# Altium project PCB_Project.PrjPcb
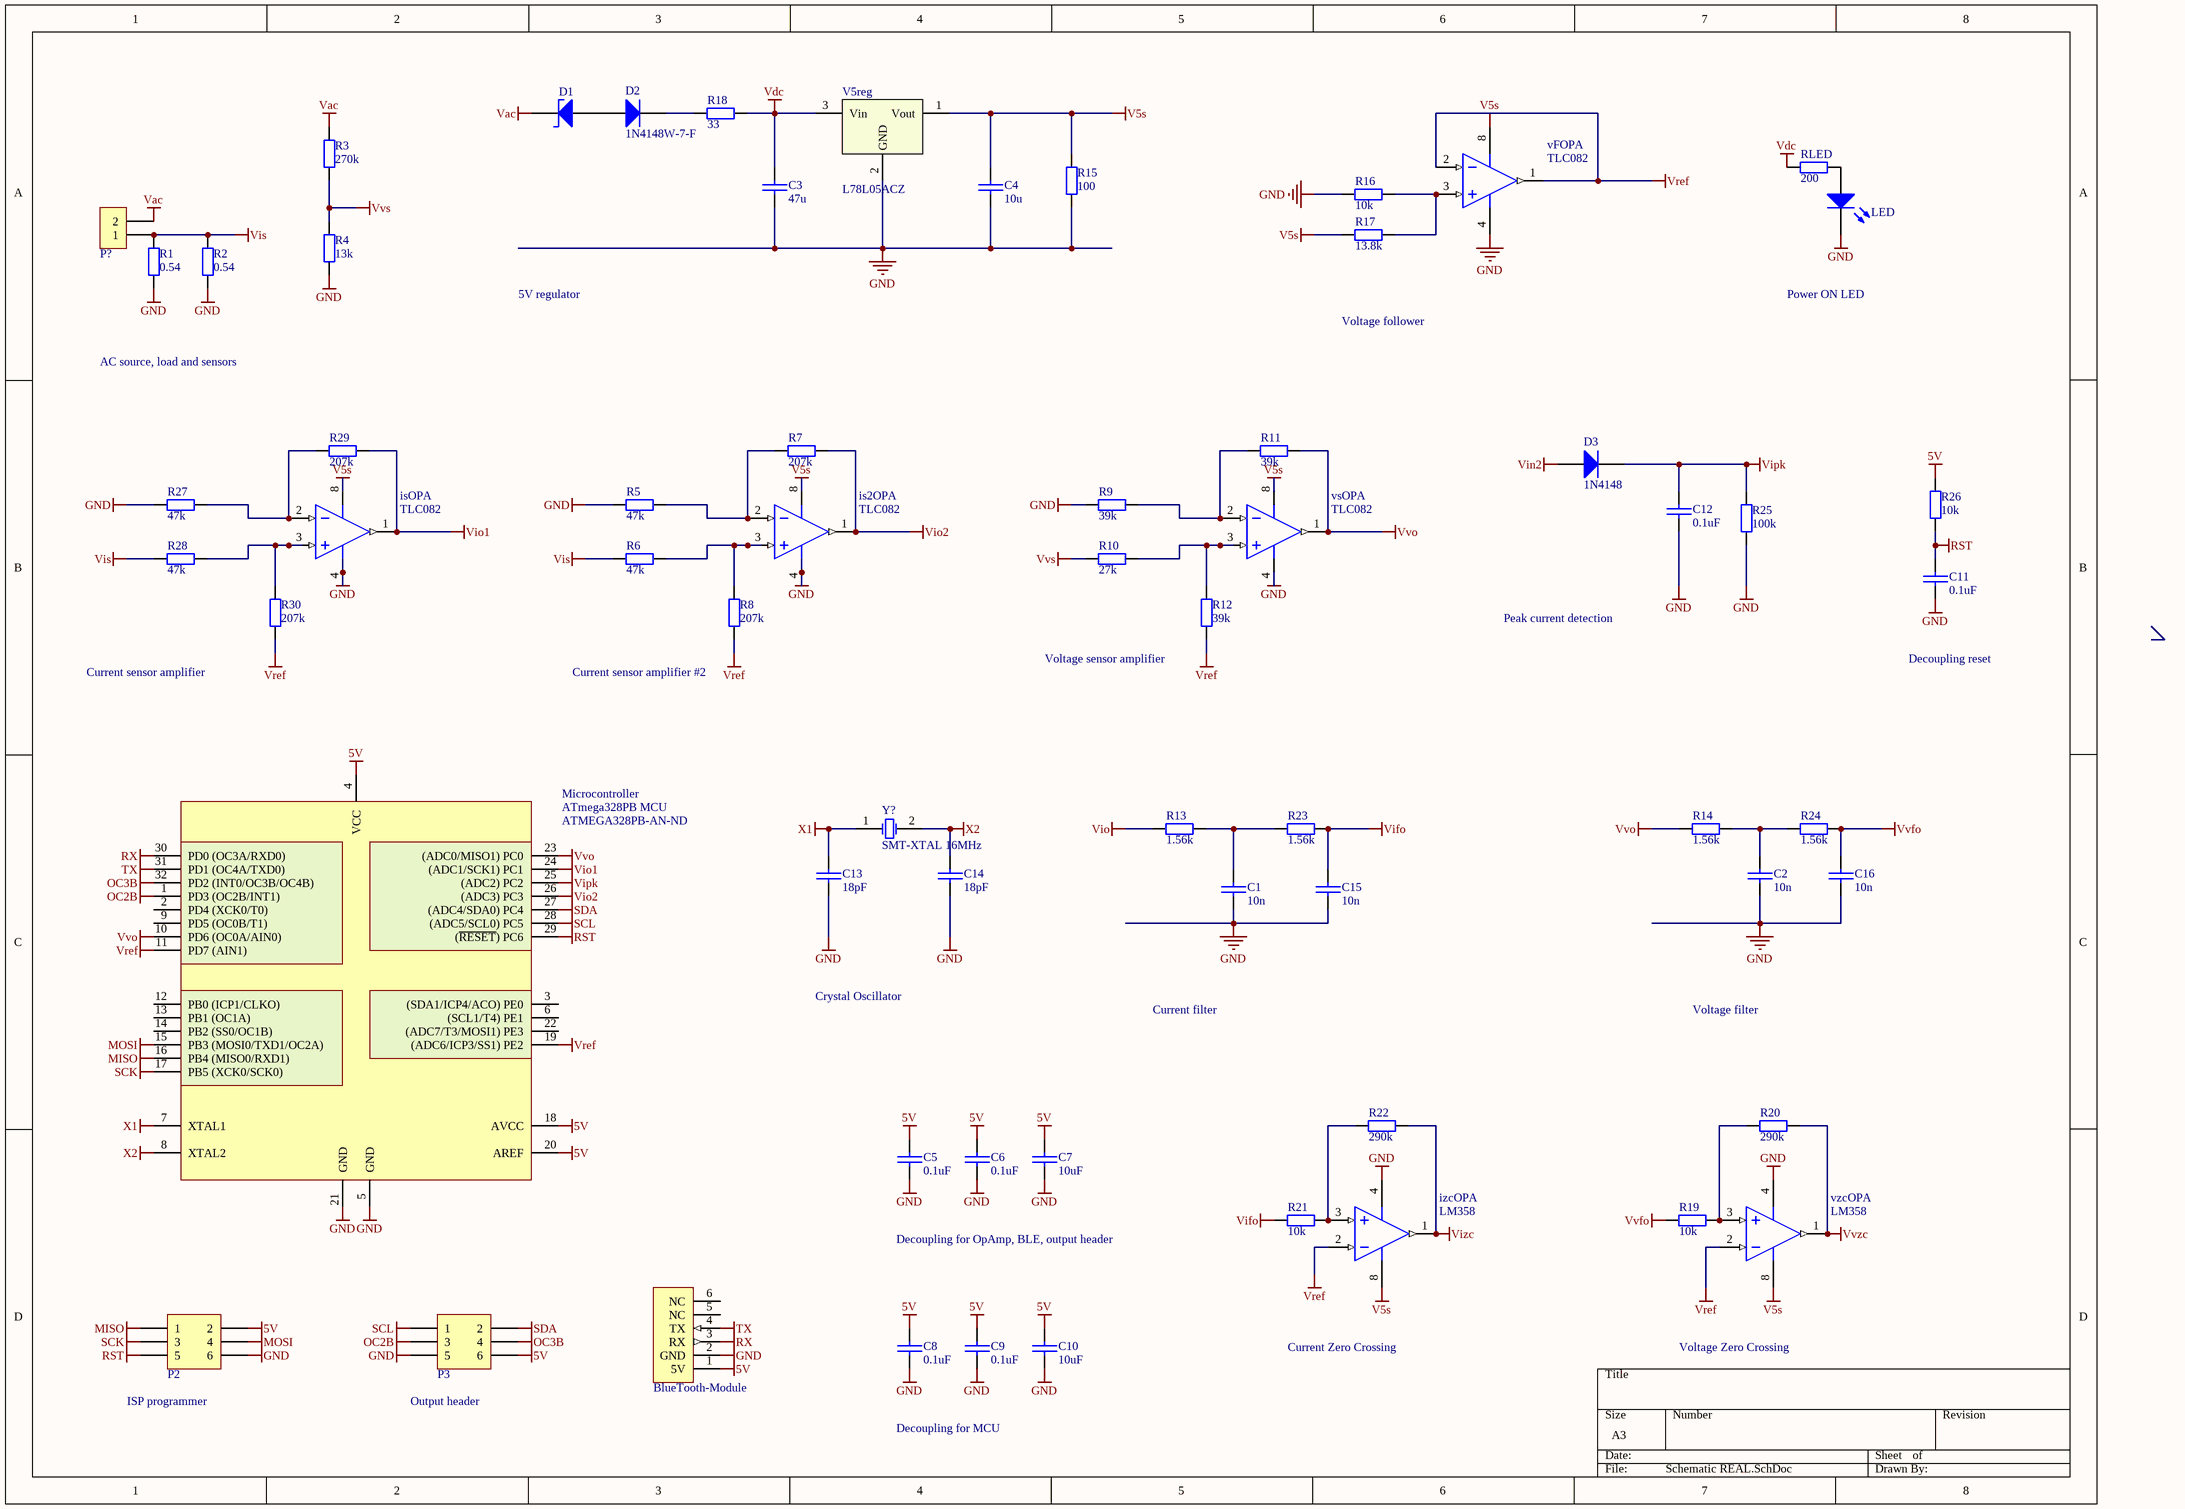
[diagram p0: Schematic REAL.SchDoc]
1 sheet, 64 parts. Net scope: global (net labels, ports and power ports of the same name join across sheets).
Board file: PCB1.PcbDoc

## Sheet Schematic REAL.SchDoc
size A3; SheetNumber: 1; SheetTotal: 1

### Parts
BlueTooth-Module  BLE Module Header  [HM10_HDR1X6]  (value not drawn)
C1  10n  [0805 CAP]
C2  10n  [0805 CAP]
C3  47u  [0805 CAP]
C4  10u  [0805 CAP]
C5  0.1uF  [0805 CAP]
C6  0.1uF  [0805 CAP]
C7  10uF  [0805 CAP]
C8  0.1uF  [0805 CAP]
C9  0.1uF  [0805 CAP]
C10  10uF  [0805 CAP]
C11  0.1uF  [0805 CAP]
C12  0.1uF  [0805 CAP]
C13  18pF  [0805 CAP]
C14  18pF  [0805 CAP]
C15  10n  [0805 CAP]
C16  10n  [0805 CAP]
D1  BZX79-CXVX  [AXIAL-Zener-0.4]  (value not drawn)
D2  1N4148W-7-F  [SOD123]
D3  1N4148  [AXIAL-DIODE-0.4]
is2OP  TLC082  [SO - 8]  (part A of 2)
isOP  TLC082  [SO - 8]  (part A of 2)
izcOP  LM358  [SO - 8]  (part A of 2)
LED  LTST-C170KGKT  [0805 LED]  (value not drawn)
Microcontroller  ATmega328PB MCU  Supplier Part Number 1: ATMEGA328PB-AN-ND  [32 - TQFP]
P2  Header 3X2  [ECE-BHDR2X3]  (value not drawn)
P3  Header 3X2  [ECE-BHDR2X3]  (value not drawn)
P?  Dual Banana Plugs  [Dual Banana Plug]  (value not drawn)
R1  0.54  [0805 RES]
R2  0.54  [0805 RES]
R3  270k  [0805 RES]
R4  13k  [0805 RES]
R5  47k  [0805 RES]
R6  47k  [0805 RES]
R7  207k  [0805 RES]
R8  207k  [0805 RES]
R9  39k  [0805 RES]
R10  27k  [0805 RES]
R11  39k  [0805 RES]
R12  39k  [0805 RES]
R13  1.56k  [0805 RES]
R14  1.56k  [0805 RES]
R15  100  [0805 RES]
R16  10k  [0805 RES]
R17  13.8k  [0805 RES]
R18  33  [0805 RES]
R19  10k  [0805 RES]
R20  290k  [0805 RES]
R21  10k  [0805 RES]
R22  290k  [0805 RES]
R23  1.56k  [0805 RES]
R24  1.56k  [0805 RES]
R25  100k  [0805 RES]
R26  10k  [0805 RES]
R27  47k  [0805 RES]
R28  47k  [0805 RES]
R29  207k  [0805 RES]
R30  207k  [0805 RES]
RLED  200  [0805 RES]
V5reg  L78L05ACZ  [TO-92]
vFOP  TLC082  [SO - 8]  (part A of 2)
vsOP  TLC082  [SO - 8]  (part A of 2)
vzcOP  LM358  [SO - 8]  (part A of 2)
Y?  SMT-XTAL 16MHz  [HC49-US]

### Nets
5V: BlueTooth-Module.1(5V) C5.1 C6.1 C7.1 C8.1 C9.1 C10.1 Microcontroller.4(VCC) Microcontroller.18(AVCC) Microcontroller.20(AREF) P2.2 P3.6 R26.2
GND: BlueTooth-Module.2(GND) C1.2 C2.2 C3.2 C4.2 C5.2 C6.2 C7.2 C8.2 C9.2 C10.2 C11.2 C12.2 C13.2 C14.2 C15.2 C16.2 is2OP.4(VSS) isOP.4(VSS) izcOP.4(VSS) LED.2(K) Microcontroller.5(GND) Microcontroller.21(GND) P2.6 P3.5 R1.1 R2.1 R4.1 R5.1 R9.1 R15.1 R16.1 R25.1 R27.1 V5reg.2(GND) vFOP.4(VSS) vsOP.4(VSS) vzcOP.4(VSS)
MISO: Microcontroller.16(PB4_(MISO0/RXD1)) P2.1
MOSI: Microcontroller.15(PB3_(MOSI0/TXD1/OC2A)) P2.4
OC2B: Microcontroller.1(PD3_(OC2B/INT1)) P3.3
OC3B: Microcontroller.32(PD2_(INT0/OC3B/OC4B)) P3.4
RST: C11.1 Microcontroller.29((~{RESET})_PC6) P2.5 R26.1
RX: BlueTooth-Module.3(RX) Microcontroller.30(PD0_(OC3A/RXD0))
SCK: Microcontroller.17(PB5_(XCK0/SCK0)) P2.3
SCL: Microcontroller.28((ADC5/SCL0)_PC5) P3.1
SDA: Microcontroller.27((ADC4/SDA0)_PC4) P3.2
TX: BlueTooth-Module.4(TX) Microcontroller.31(PD1_(OC4A/TXD0))
V5s: C4.1 is2OP.8(VDD) isOP.8(VDD) izcOP.8(VDD) R15.2 R17.1 V5reg.1(Vout) vFOP.8(VDD) vsOP.8(VDD) vzcOP.8(VDD)
Vac: D1.2(K) P?.2 R3.2
Vdc: C3.1 R18.1 RLED.1 V5reg.3(Vin)
Vifo: C15.1 R21.1 R23.2
Vin2: D3.1(A)
Vio: R13.1
Vio1: isOP.1(VOUTA) Microcontroller.24((ADC1/SCK1)_PC1) R29.2
Vio2: is2OP.1(VOUTA) Microcontroller.26((ADC3)_PC3) R7.2
Vipk: C12.1 D3.2(K) Microcontroller.25((ADC2)_PC2) R25.2
Vis: P?.1 R1.2 R2.2 R6.1 R28.1
Vizc: izcOP.1(VOUTA) R22.2
Vref: izcOP.2(VINA-) Microcontroller.11(PD7_(AIN1)) Microcontroller.19((ADC6/ICP3/SS1)_PE2) R8.2 R12.2 R30.2 vFOP.1(VOUTA) vFOP.2(VINA-) vzcOP.2(VINA-)
Vvfo: C16.1 R19.1 R24.2
Vvo: Microcontroller.10(PD6_(OC0A/AIN0)) Microcontroller.23((ADC0/MISO1)_PC0) R11.2 R14.1 vsOP.1(VOUTA)
Vvs: R3.1 R4.2 R10.1
Vvzc: R20.2 vzcOP.1(VOUTA)
X1: C13.1 Microcontroller.7(XTAL1) Y?.1(OSC1)
X2: C14.1 Microcontroller.8(XTAL2) Y?.2(OSC2)
NetC1_1: C1.1 R13.2 R23.1
NetC2_1: C2.1 R14.2 R24.1
NetD1_1: D1.1(A) D2.1(A)
NetD2_2: D2.2(K) R18.2
Netis2OP_2: is2OP.2(VINA-) R5.2 R7.1
Netis2OP_3: is2OP.3(VINA+) R6.2 R8.1
NetisOP_2: isOP.2(VINA-) R27.2 R29.1
NetisOP_3: isOP.3(VINA+) R28.2 R30.1
NetizcOP_3: izcOP.3(VINA+) R21.2 R22.1
NetLED_1: LED.1(A) RLED.2
NetR9_2: R9.2 R11.1 vsOP.2(VINA-)
NetR10_2: R10.2 R12.1 vsOP.3(VINA+)
NetR16_2: R16.2 R17.2 vFOP.3(VINA+)
NetR19_2: R19.2 R20.1 vzcOP.3(VINA+)

Not connected (* = marked no-connect by the designer): BlueTooth-Module 5(NC) 6(NC); Microcontroller 2(PD4_(XCK0/T0)) 3((SDA1/ICP4/ACO)_PE0) 6((SCL1/T4)_PE1) 9(PD5_(OC0B/T1)) 12(PB0_(ICP1/CLKO)) 13(PB1_(OC1A)) 14(PB2_(SS0/OC1B)) 22((ADC7/T3/MOSI1)_PE3)

### Notes on the sheet
- 5V regulator
- Power ON LED
- AC source, load and sensors
- Voltage follower
- Peak current detection
- Current sensor amplifier
- (near R8) Current sensor amplifier #2
- (near R12) Voltage sensor amplifier
- Decoupling reset
- Crystal Oscillator
- Current filter
- Voltage filter
- Decoupling for OpAmp, BLE, output header
- Current Zero Crossing
- Voltage Zero Crossing
- (near P2) ISP programmer
- (near P3) Output header
- Decoupling for MCU

### Library data of the parts
BlueTooth-Module = BLEModule_TH: 2.54mm pitch 6-pin header for BLE module; LatestRevisionDate: 17-Jul-2002; LatestRevisionNote: Re-released for DXP Platform.; Publisher: Altium Limited
C1-C16 = CerCap_SMT_0805: SMT ceramic capacitor 0805 size; Value: *
D1 = Zener_TH_4AX0: Axial zener diode BZX79 series; Manufacturer: Nexperia USA Inc.; Manufacturer Part Number: BZX79-C4V7,143; Tolerance: ±5%; Supplier 1: Digi-Key; RoHS: RoHS Compliant; Category: Discrete Semiconductor Products; Stock 1: 8933; Pricing 1: 1=0.23, 10=0.206, 100=0.1123, 500=0.06912, 1000=0.04714 (NZD); Packaging: Cut Tape (CT); Part Status: Active; Operating Temperature: -65°C ~ 200°C; Mounting Type: Through Hole; Package / Case: DO-204AH, DO-35, Axial; Supplier Device Package: DO-35; ComponentLink1URL: https://assets.nexperia.com/documents/data-sheet/BZX79.pdf; ComponentLink1Description: https://assets.nexperia.com/documents/data-sheet/BZX79.pdf; Supplier Part Number 1: 1727-1864-1-ND
D2 = 1N4148_SMT_SOD123: DIODE GEN PURP 100V 300MA SOD123; Manufacturer: Diodes Incorporated; Manufacturer Part Number: 1N4148W-13-F; Diode Type: Standard; Current - Average Rectified (Io): 150mA; Speed: Small Signal =< 200mA (Io), Any Speed; Capacitance @ Vr, F: 2pF @ 0V, 1MHz; Supplier 1: Digi-Key; RoHS: RoHS Compliant; Category: Discrete Semiconductor Products; Stock 1: 5282; Pricing 1: 1=0.33, 10=0.292, 100=0.1586, 500=0.0976, 1000=0.06656 (NZD); Packaging: Cut Tape (CT); Part Status: Active; Mounting Type: Surface Mount; Package / Case: SOD-123; Supplier Device Package: SOD-123; Operating Temperature - Junction: -65°C ~ 150°C; Base Part Number: 1N4148W; ComponentLink1URL: https://www.diodes.com/assets/Datasheets/ds30086.pdf; ComponentLink1Description: https://www.diodes.com/assets/Datasheets/ds30086.pdf; Supplier Part Number 1: 1N4148W-13FDICT-ND
D3 = 1N4148_TH_4AX0: 1N4148 100V 200mA axial diode; Manufacturer: ON Semiconductor; Manufacturer Part Number: 1N4148TR; Diode Type: Standard; Speed: Small Signal =< 200mA (Io), Any Speed; Capacitance @ Vr, F: 4pF @ 0V, 1MHz; Supplier 1: Digi-Key; RoHS: RoHS Compliant; Category: Discrete Semiconductor Products; Stock 1: 1658049; Pricing 1: 1=0.16, 10=0.109, 100=0.0592, 500=0.03648, 1000=0.02488 (NZD); Part Status: Active; Current - Average Rectified (Io): 200mA; Mounting Type: Through Hole; Package / Case: DO-204AH, DO-35, Axial; Supplier Device Package: DO-35; Operating Temperature - Junction: -65°C ~ 175°C; Base Part Number: 1N4148; ComponentLink1URL: https://www.fairchildsemi.com/datasheets/1N/1N914.pdf; ComponentLink1Description: https://www.fairchildsemi.com/datasheets/1N/1N914.pdf; Supplier Part Number 1: 1N4148FSCT-ND
is2OP isOP vFOP vsOP = TLC082_SMT_SOIC8: IC OPAMP GP 10MHZ 8SOIC; Manufacturer: Texas Instruments; Manufacturer Part Number: TLC082CDR; Amplifier Type: General Purpose; Slew Rate: 19 V/µs; Current - Supply: 1.9mA; Voltage - Supply, Single/Dual (±): 4.5 V ~ 16 V, ±2.25 V ~ 8 V; Supplier 1: Digi-Key; RoHS: RoHS Compliant; Category: Integrated Circuits (ICs); Stock 1: 29765; Pricing 1: 1=3.44, 10=3.087, 100=2.4808, 500=2.03822, 1000=1.68881 (NZD); Packaging: Cut Tape (CT); Part Status: Active; Output Type: -; Operating Temperature: 0°C ~ 70°C; Mounting Type: Surface Mount; Package / Case: 8-SOIC (0.154", 3.90mm Width); Supplier Device Package: 8-SOIC; Base Part Number: TLC082; ComponentLink1URL: http://www.ti.com/lit/ds/symlink/tlc080a.pdf; ComponentLink1Description: http://www.ti.com/lit/ds/symlink/tlc080a.pdf; Supplier Part Number 1: 296-2421-1-ND
izcOP vzcOP = LM358_SMT_SOIC8: IC OPAMP 8SOIC; ComponentLink1URL: http://www.ti.com/lit/ds/symlink/tlc080a.pdf; ComponentLink1Description: http://www.ti.com/lit/ds/symlink/tlc080a.pdf; Supplier 1: Digi-Key; Supplier Part Number 1: 296-1014-1-ND
LED = LED_SMT_0805: SMT LED 0805 size; Manufacturer: Lite-On Inc.; Lens Color: Colorless; Lens Transparency: Clear; Millicandela Rating: 35mcd; Lens Style/Size: Rectangle with Flat Top, 1.40mm x 1.25mm; Voltage - Forward (Vf) (Typ): 2V; Current - Test: 20mA; Viewing Angle: 130°; Wavelength - Dominant: 571nm; Wavelength - Peak: 574nm; Supplier 1: Digi-Key; Manufacturer Part Number: LTST-C170KGKT; RoHS: RoHS Compliant; Category: Optoelectronics; Stock 1: 503069; Pricing 1: 1=0.62, 10=0.459, 25=0.338, 100=0.2415, 250=0.16416, 500=0.14486, 1000=0.11347 (NZD); Packaging: Cut Tape (CT); Part Status: Active; Color: Green; Mounting Type: Surface Mount; Features: -; Package / Case: 0805 (2012 Metric); Size / Dimension: 2.00mm L x 1.25mm W; Height (Max): 1.10mm; ComponentLink1URL: http://optoelectronics.liteon.com/upload/download/DS22-2000-073/LTST-C170KGKT.pdf; ComponentLink1Description: http://optoelectronics.liteon.com/upload/download/DS22-2000-073/LTST-C170KGKT.pdf; Supplier Part Number 1: 160-1414-1-ND
Microcontroller = ATmega328PB_SMT_TQFP32: IC MCU 8BIT 32KB FLASH 32TQFP; Manufacturer: Atmel; Manufacturer Part Number: ATMEGA328PB-AN; Core Processor: AVR; Core Size: 8-Bit; Speed: 20MHz; Connectivity: I²C, SPI, UART/USART; Peripherals: Brown-out Detect/Reset, POR, PWM, WDT; Number of I/O: 27; Program Memory Size: 32KB (16K x 16); EEPROM Size: 1K x 8; RAM Size: 2K x 8; Voltage - Supply (Vcc/Vdd): 1.8 V ~ 5.5 V; Data Converters: A/D 8x10b; Oscillator Type: Internal; Supplier 1: Digi-Key; RoHS: RoHS Compliant; Category: Integrated Circuits (ICs); Stock 1: 366; Pricing 1: 1=2.74, 10=2.448, 25=2.2032, 100=2.0074, 250=1.81152, 500=1.62548, 1000=1.37088 (USD); Packaging: Tray; Part Status: Active; Program Memory Type: FLASH; Operating Temperature: -40°C ~ 105°C (TA); Package / Case: 32-TQFP; Supplier Device Package: 32-TQFP (7x7); ComponentLink1URL: http://www.atmel.com/images/atmel-42397-8-bit-avr-microcontroller-atmega328pb_datasheet.pdf; ComponentLink1Description: http://www.atmel.com/images/atmel-42397-8-bit-avr-microcontroller-atmega328pb_datasheet.pdf
P? = AC_Output: Dual banana plugs connection to the AC load; LatestRevisionDate: 17-Jul-2002; LatestRevisionNote: Re-released for DXP Platform.; Publisher: Altium Limited
R1-R30 RLED = Res_SMT_0805: 0805 resistor; Published: 8-Jun-2000; LatestRevisionDate: 17-Jul-2002; LatestRevisionNote: Re-released for DXP Platform.; PackageReference: AXIAL-0.4; Publisher: Altium Limited; Value: *; ComponentLink1Description: https://nz.mouser.com/datasheet/2/315/AOA0000C304-1149620.pdf
V5reg = L78L05_TH_TO92: Voltage Regulator 5V; Manufacturer: ON Semiconductor; Manufacturer Part Number: LM78L05ACZX; Output Configuration: Positive; Output Type: Fixed; Voltage - Input (Max): 30V; Current - Output: 100mA; PSRR: 80dB (120Hz); Protection Features: Over Temperature, Short Circuit; Supplier 1: Digi-Key; RoHS: RoHS Compliant; Category: Integrated Circuits (ICs); Stock 1: 7782; Pricing 1: 1=0.69, 10=0.517, 100=0.3226, 500=0.2207, 1000=0.16976 (NZD); Packaging: Cut Tape (CT); Part Status: Active; Voltage - Output (Min/Fixed): 5V; Voltage - Output (Max): -; Voltage Dropout (Max): -; Control Features: -; Operating Temperature: -40°C ~ 125°C; Mounting Type: Through Hole; Package / Case: TO-226-3, TO-92-3 (TO-226AA) (Formed Leads); Supplier Device Package: TO-92-3; Base Part Number: LM78L05; ComponentLink1URL: https://www.fairchildsemi.com/datasheets/MC/MC78L05A.pdf; ComponentLink1Description: https://www.fairchildsemi.com/datasheets/MC/MC78L05A.pdf; Supplier Part Number 1: LM78L05ACZXCT-ND
Y? = TXC9C-16_XTAL_SMT: 9C-16.000MAAJ-T crystal 16.0000MHZ 18PF SMD; Manufacturer: TXC CORPORATION; Frequency Stability: ±30ppm; Operating Mode: Fundamental; Supplier 1: Digi-Key; Manufacturer Part Number: 9C-16.000MAAJ-T; RoHS: RoHS Compliant; Category: Crystals, Oscillators, Resonators; Stock 1: 11514; Pricing 1: 1=0.75, 10=0.628, 50=0.5656, 100=0.5026, 500=0.47744 (NZD); Packaging: Cut Tape (CT); Part Status: Active; Type: MHz Crystal; Frequency Tolerance: ±30ppm; Load Capacitance: 18pF; Operating Temperature: -20°C ~ 70°C; Ratings: -; Mounting Type: Surface Mount; Package / Case: HC-49/US; Size / Dimension: 0.449" L x 0.189" W (11.40mm x 4.80mm); Height - Seated (Max): 0.161" (4.10mm); ComponentLink1URL: http://www.txccorp.com/download/products/quartz_crystals/2015TXC_9C_32.pdf; ComponentLink1Description: http://www.txccorp.com/download/products/quartz_crystals/2015TXC_9C_32.pdf; Supplier Part Number 1: 887-1059-1-ND